# EAGLE design sensor_board (EAGLE 7.2.0)
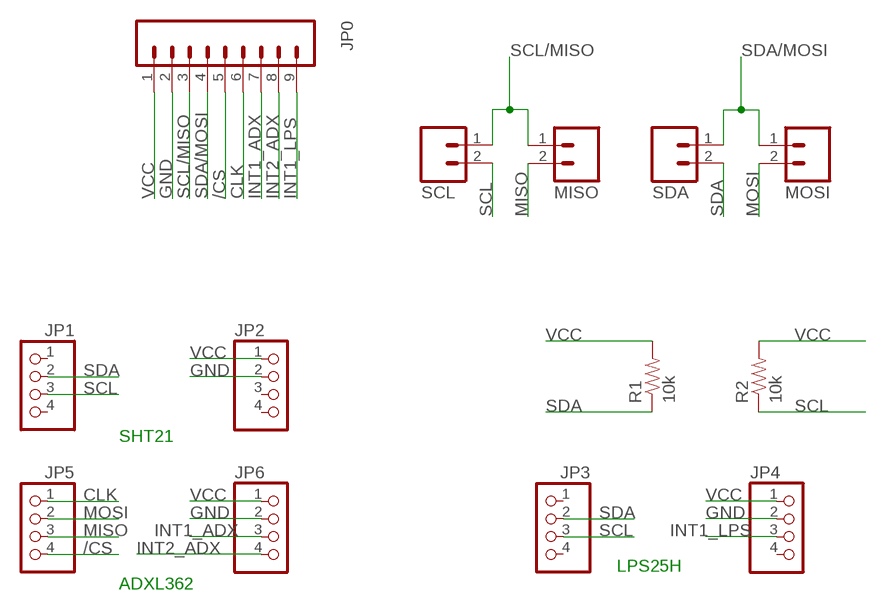
[diagram p0: schematic, sheet 1]

## Parts
JP0  M09  [1X09]
JP1  PINHD-1X4  [1X04]
JP2  PINHD-1X4  [1X04]
JP3  PINHD-1X4  [1X04]
JP4  PINHD-1X4  [1X04]
JP5  PINHD-1X4  [1X04]
JP6  PINHD-1X4  [1X04]
MISO  M02PTH  [1X02]
MOSI  M02PTH  [1X02]
R1  10k  10KOHM-1/4W5%(PTH)  [AXIAL-0.3]
R2  10k  10KOHM-1/4W5%(PTH)  [AXIAL-0.3]
SCL  M02PTH  [1X02]
SDA  M02PTH  [1X02]

## Nets
/CS: JP0.5 JP5.4
CLK: JP0.6 JP5.1
GND: JP0.2 JP2.2 JP4.2 JP6.2
INT1_ADX: JP0.7 JP6.3
INT1_LPS: JP0.9 JP4.3
INT2_ADX: JP0.8 JP6.4
MISO: JP5.3 MISO.2
MOSI: JP5.2 MOSI.2
SCL: JP1.3 JP3.3 R2.P$1 SCL.2
SCL/MISO: JP0.3 MISO.1 SCL.1
SDA: JP1.2 JP3.2 R1.P$1 SDA.2
SDA/MOSI: JP0.4 MOSI.1 SDA.1
VCC: JP0.1 JP2.1 JP4.1 JP6.1 R1.P$2 R2.P$2
Unconnected: JP1.1 JP1.4 JP2.3 JP2.4 JP3.1 JP3.4 JP4.4

## Notes on the sheet
- SHT21
- LPS25H
- ADXL362

## Library data of the parts
JP0 = SparkFun-Connectors:M09: Header 9 Standard 9-pin 0.1" header. Use with straight break away headers (SKU : PRT-00116), right angle break away headers (PRT-00553), swiss pins (PRT-00743), machine pins (PRT-00117), and female headers (PRT-00115).
JP1-JP6 = pinhead:PINHD-1X4: PIN HEADER
MISO MOSI SCL SDA = SparkFun-Connectors:M02: Standard 2-pin 0.1" header. Use with - straight break away headers ( PRT-00116) - right angle break away headers (PRT-00553) - swiss pins (PRT-00743) - machine pins (PRT-00117) - female headers (PRT-00115) Molex polarized connector foot print use with: PRT-08233 with associated crimp pins and housings. 2.54_SCREWTERM for use with PRT-10571. 3.5mm Screw Terminal footprints for PRT-08084 5mm Screw Terminal footprints for use with PRT-08432
R1 R2 = SparkFun-Resistors:10KOHM-1/4W5%(PTH): RES-09435; PROD_ID: RES-9435

## Board
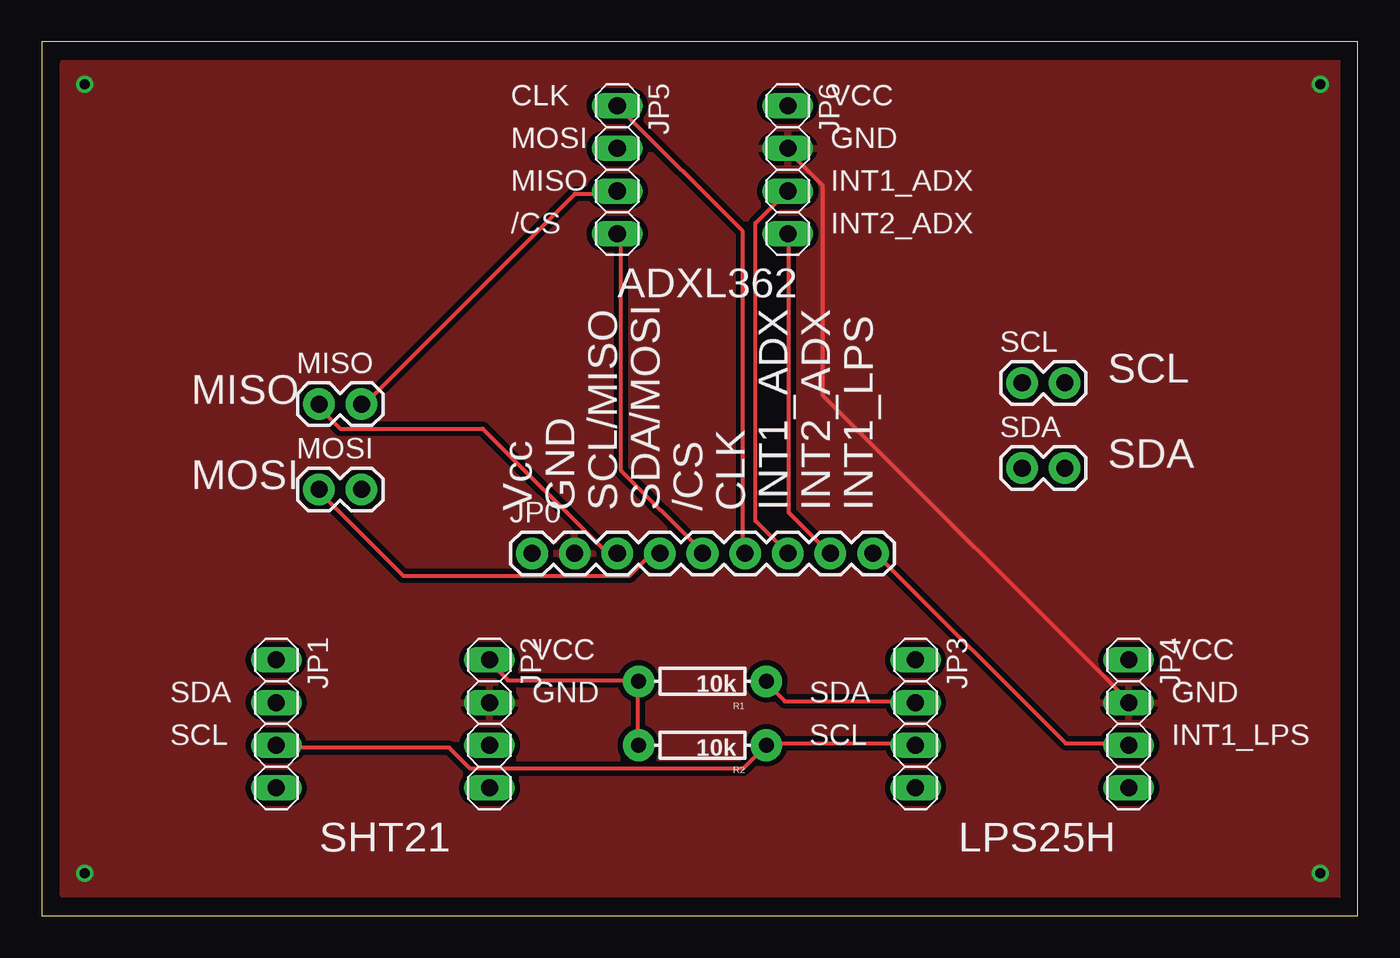
[diagram p1: board, top side]
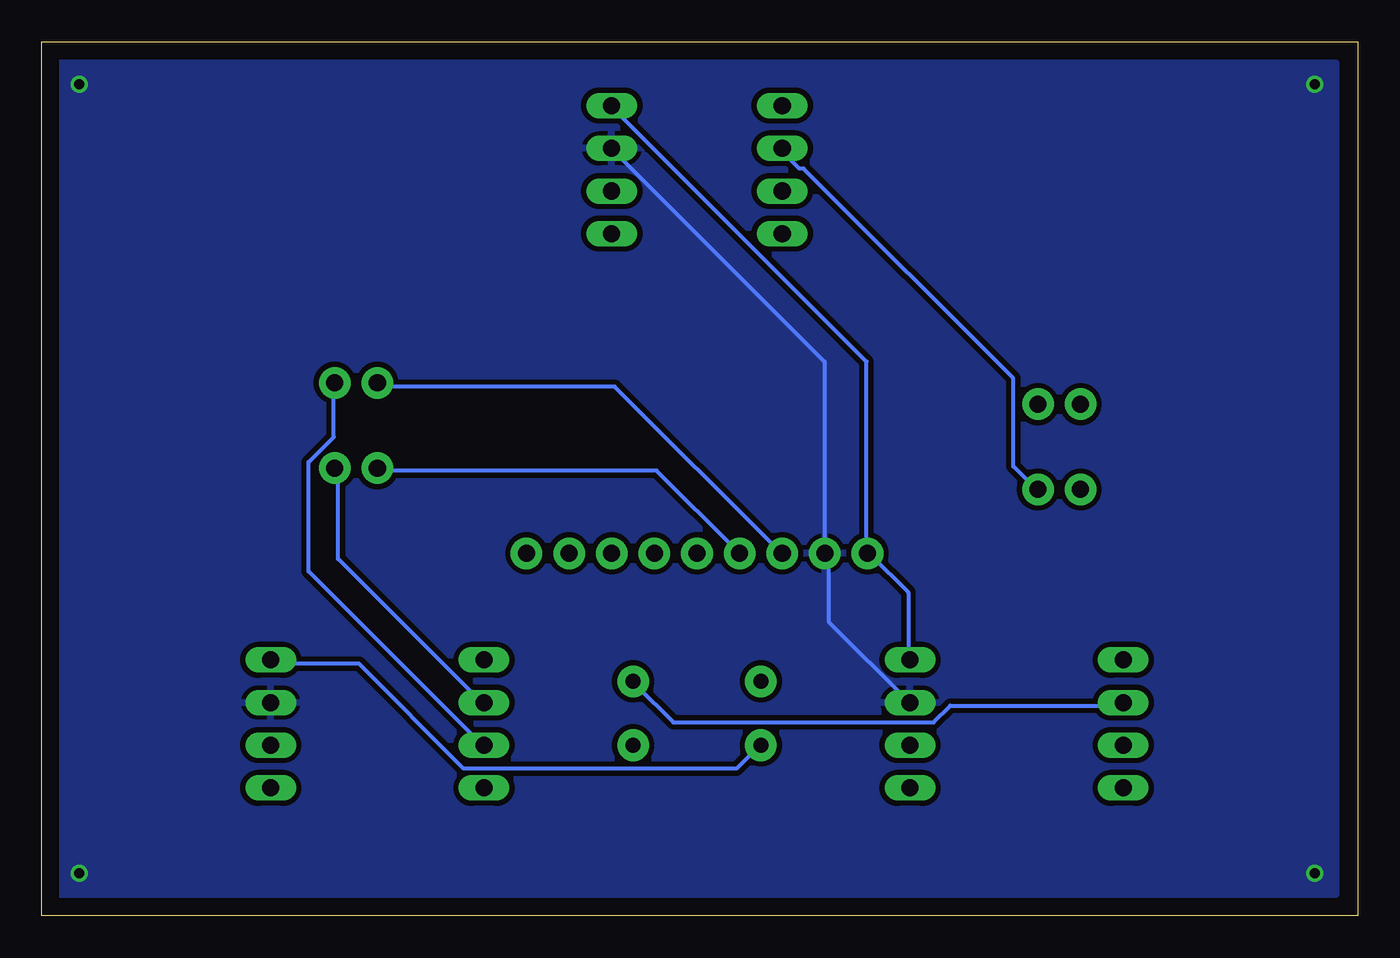
[diagram p2: board, bottom side, seen from below]

Size 78.41 x 52.06 mm. Coordinates in mm from the lower left corner, seen from the top.
Outline: 0,0 78.41,0 78.41,52.06 0,52.06 0,0
Copper layers (1*16): Top 0.035mm / dielectric 1.5mm / Bottom 0.035mm
Design rules "default *": minimum track width 0.25mm, minimum drill 0.3mm, track to track 0.25mm, track to pad 0.25mm, pad to pad 0.25mm, via to via 0.25mm, smd to smd 0.25mm, copper to edge 40mil, drill to drill 8mil, minimum pad ring 10mil, minimum via ring 8mil, stop-mask expansion 4mil, vias tented up to drill 0mil, thermal gap 10mil

### Footprints (pad centres in the part's own frame; a part is rotated, then mirrored left to right if it is on the bottom)
1X09 = drill 1.016 pad 1.88: 1 0,0; 2 2.54,0; 3 5.08,0; 4 7.62,0; 5 10.16,0; 6 12.7,0; 7 15.24,0; 8 17.78,0; 9 20.32,0
1X04 = drill 1.016 long: 1 -3.81,0; 2 -1.27,0; 3 1.27,0; 4 3.81,0
1X02 = drill 1.016 pad 1.88: 1 0,0; 2 2.54,0
AXIAL-0.3 = drill 0.9 pad 1.88: P$1 -3.81,0; P$2 3.81,0

### Placement (x,y rotation side)
JP0  29.21,21.59 0 top
JP1  13.97,11.43 270 top
JP2  26.67,11.43 270 top
JP3  52.07,11.43 270 top
JP4  64.77,11.43 270 top
JP5  34.29,44.45 270 top
JP6  44.45,44.45 270 top
MISO  16.51,30.48 0 top
MOSI  16.51,25.4 0 top
R1  39.37,13.97 180 top
R2  39.37,10.16 180 top
SCL  58.42,31.75 0 top
SDA  58.42,26.67 0 top

### Tracks (layer width: path | path; a pad name or v marks a point on that pad's centre or on a via)
/CS
  Top 0.25: JP5.4 34.52,40.52 34.52,26.52 39.27,21.77 JP0.5
CLK
  Top 0.25: JP5.1 34.52,48.02 41.77,40.77 41.77,21.77 JP0.6
GND  (via drill 0.6)
  Top 0.25: JP4.2 64.77,12.77 46.52,31.02 46.52,43.52 44.52,45.52 JP6.2
  Bottom 0.25: JP2.2 26.77,12.77 31.52,17.52 31.52,21.52 JP0.2 31.77,21.77 31.77,33.02 44.27,45.52 JP6.2
  other vias: 2.54,49.53 2.54,2.54 76.2,2.54 76.2,49.53
  pour Bottom (isolate 0.305, rank 6): 1.27,50.8 77.47,50.8 77.47,1.27 1.27,1.27
  pour Top (isolate 0.305): 1.27,50.8 77.47,50.8 77.47,1.27 1.27,1.27
  pour Bottom (isolate 0.305): 1.27,50.8 77.47,50.8 77.47,1.27 1.27,1.27
INT1_ADX
  Top 0.25: JP0.7 42.52,23.52 42.52,41.27 44.27,43.02 JP6.3
INT1_LPS
  Top 0.25: JP4.3 64.77,10.27 61.02,10.27 49.77,21.52 JP0.9
INT2_ADX
  Top 0.25: JP6.4 44.52,40.52 44.52,24.02 46.77,21.77 JP0.8
MISO
  Top 0.25: JP5.3 34.27,43.02 31.77,43.02 19.27,30.52 MISO.2
MOSI
  Bottom 0.25: JP5.2 34.27,45.52 33.27,44.52 33.02,44.52 20.52,32.02 20.52,26.77 19.27,25.52 MOSI.2
SCL
  Top 0.25: JP1.3 14.02,10.02 24.27,10.02 25.52,8.77 41.77,8.77 43.02,10.02 R2.P$1 43.27,10.27 52.02,10.27 JP3.3
  Bottom 0.25: SCL.2 61.02,31.52 61.02,28.52 62.52,27.02 62.52,20.52 52.27,10.27 JP3.3
SCL/MISO
  Top 0.25: JP0.3 34.27,21.77 33.52,21.77 26.27,29.02 17.77,29.02 16.52,30.27 MISO.1
  Bottom 0.25: SCL.1 58.27,31.52 44.27,31.52 34.52,21.77 JP0.3
SDA
  Top 0.25: JP3.2 52.02,12.77 44.27,12.77 43.27,13.77 R1.P$1
  Bottom 0.25: JP1.2 14.02,12.52 24.27,12.52 25.27,11.52 40.77,11.52 43.02,13.77 R1.P$1 | SDA.2 60.77,26.52 60.77,21.27 52.27,12.77 JP3.2
SDA/MOSI
  Top 0.25: JP0.4 36.77,21.52 36.27,21.52 35.02,20.27 21.52,20.27 16.52,25.27 MOSI.1
  Bottom 0.25: SDA.1 58.27,26.52 41.77,26.52 37.02,21.77 JP0.4
VCC
  Top 0.25: R2.P$2 35.52,10.27 35.52,13.77 R1.P$2 35.52,14.02 27.77,14.02 26.77,15.02 JP2.1
  Bottom 0.25: JP4.1 64.77,15.02 59.52,15.02 53.27,8.77 37.02,8.77 35.77,10.02 R2.P$2 | JP2.1 26.77,15.27 26.77,19.27 29.02,21.52 JP0.1 29.27,21.77 29.27,33.02 44.27,48.02 JP6.1

### Text on the board
tPlace: CLK | VCC | MOSI | GND | MISO | INT1_ADX | /CS | INT2_ADX | ADXL362 | SCL | MISO | SDA | MOSI | Vcc | GND | SCL/MISO | SDA/MOSI | /CS | CLK | INT1_ADX | INT2_ADX | INT1_LPS | VCC | VCC | SDA | GND | SDA | GND | SCL | SCL | INT1_LPS | SHT21 | LPS25H